# Altium schematic sheet Smart Control and Security System.SchDoc (part 1 of 2)
size 840 x 594 mm; ApprovedBy: Лазарев В.П.; DrawnBy: Лазарев В.П.; SheetTotal: 1; PageSetup: Record=PageOptions|CenterHorizontal=True|CenterVertical=True|PrintScale=1.00|XCorrection=1.00|YCorrection=1.00|PrintKind=0|BorderSize=5000000|LeftOffset=0|BottomOffset=0|Orientation=1|PaperLength=1000|PaperWidth=1000|Scale=100|PaperSource=7|PrintQuality=600|MediaType=1|DitherType=10|PaperKind=A3|PrintScaleMode=0
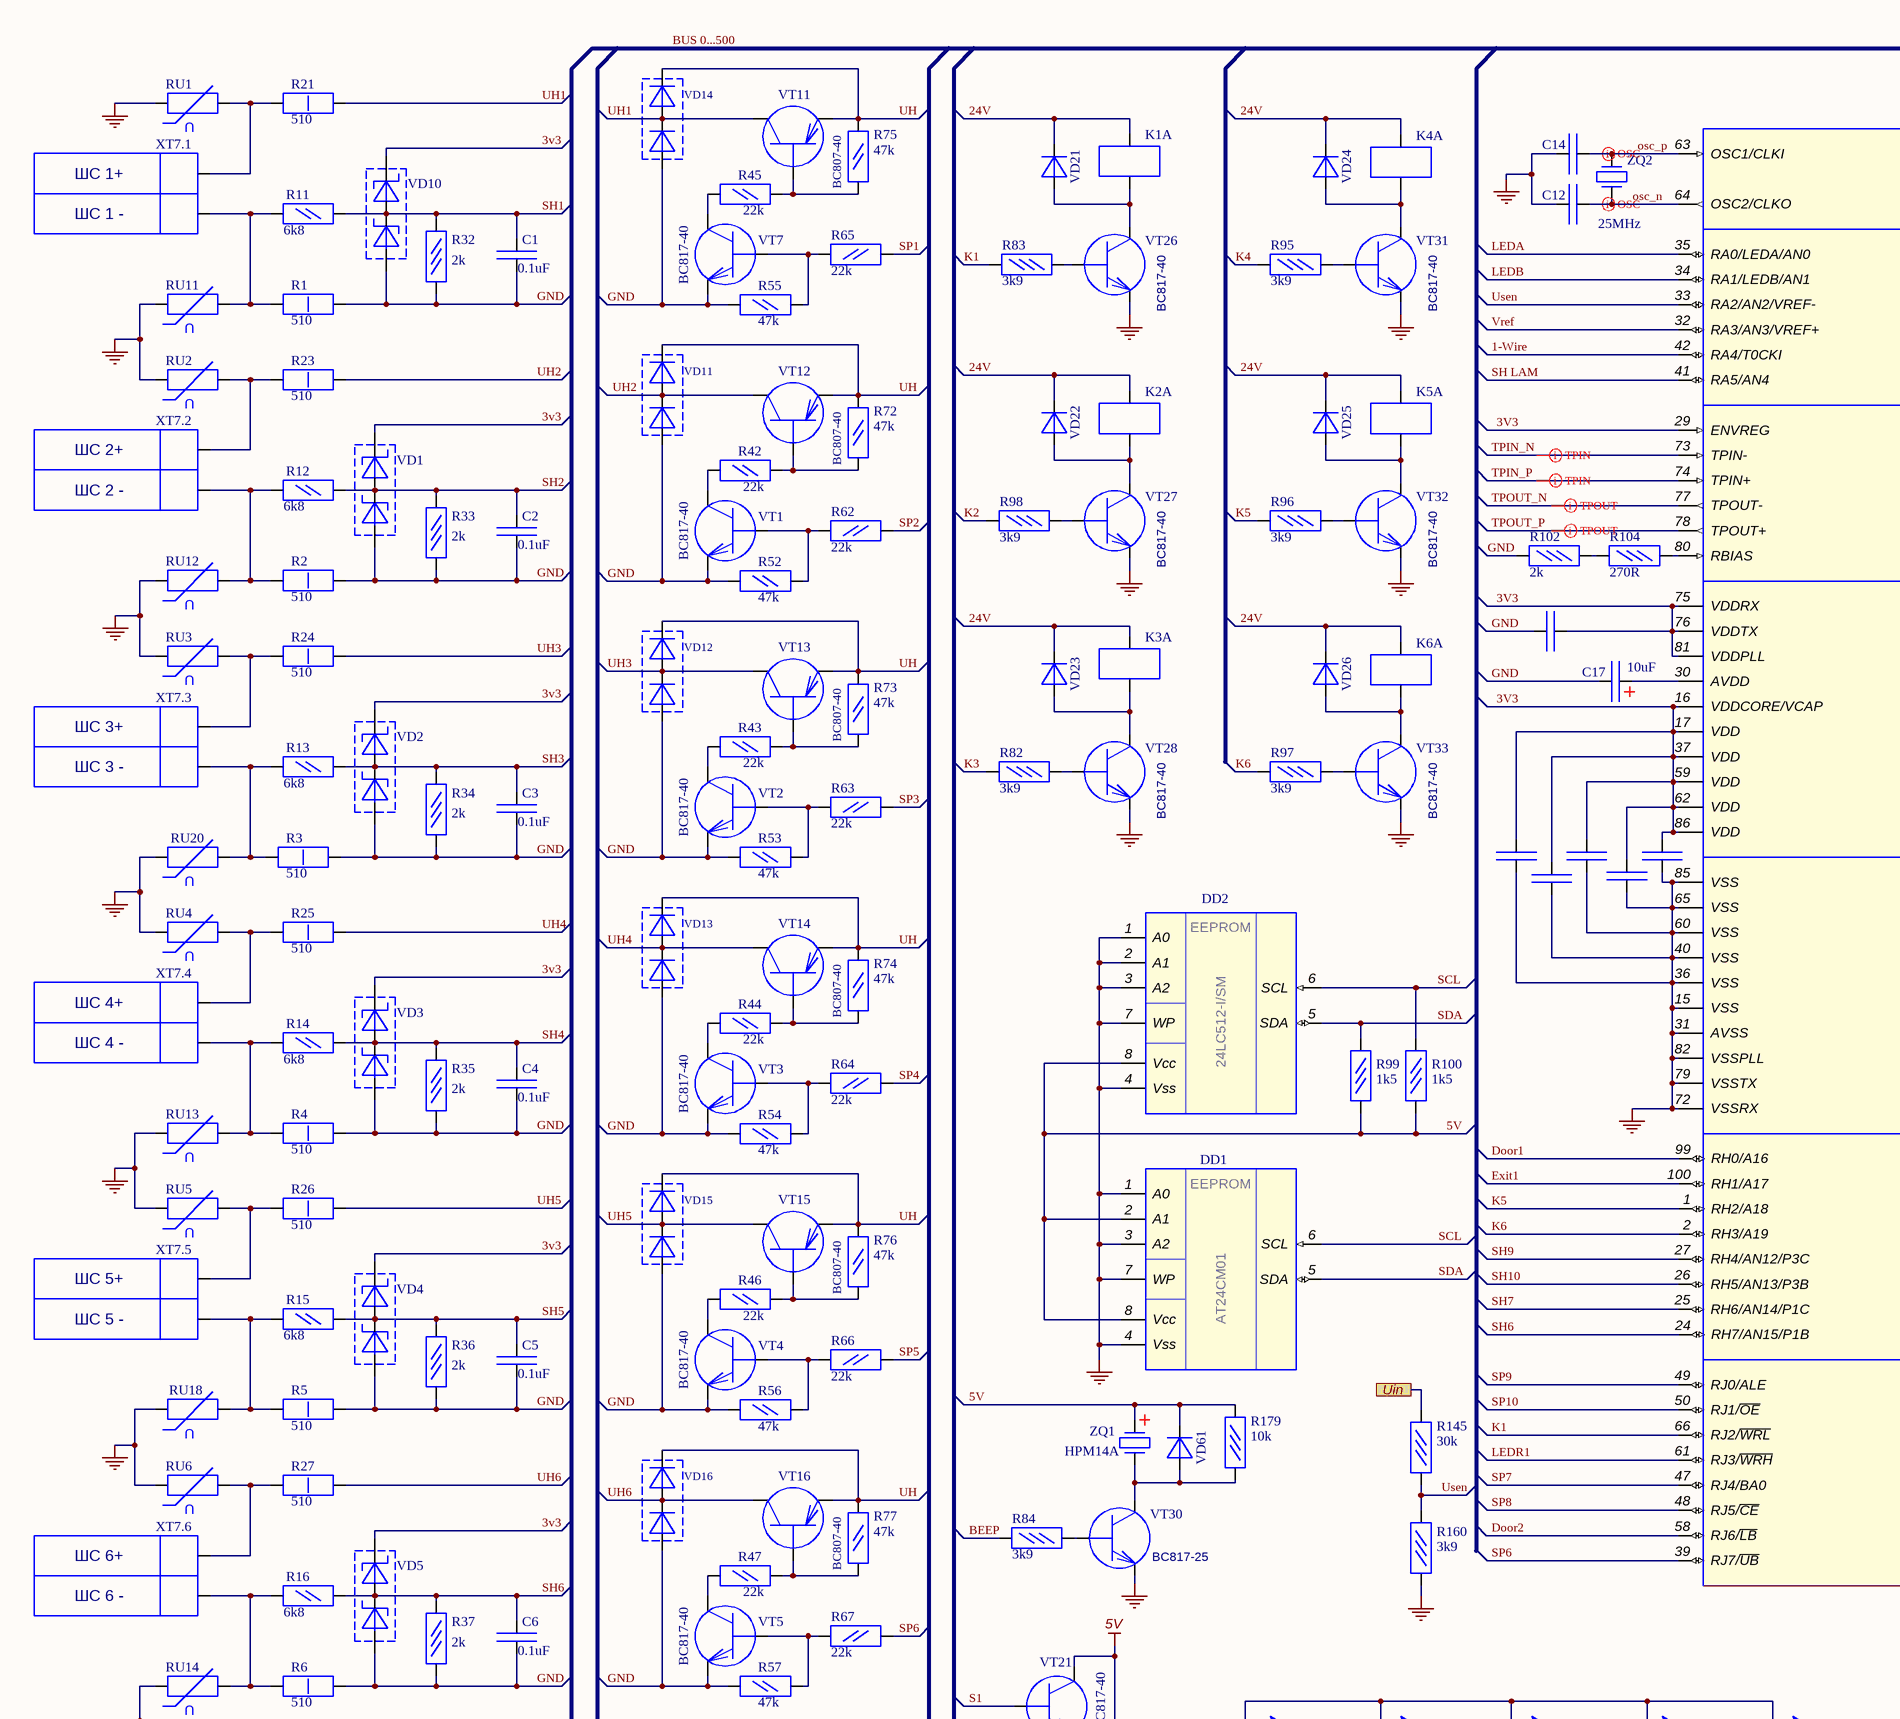
[diagram p0: Smart Control and Security System.SchDoc, top left]
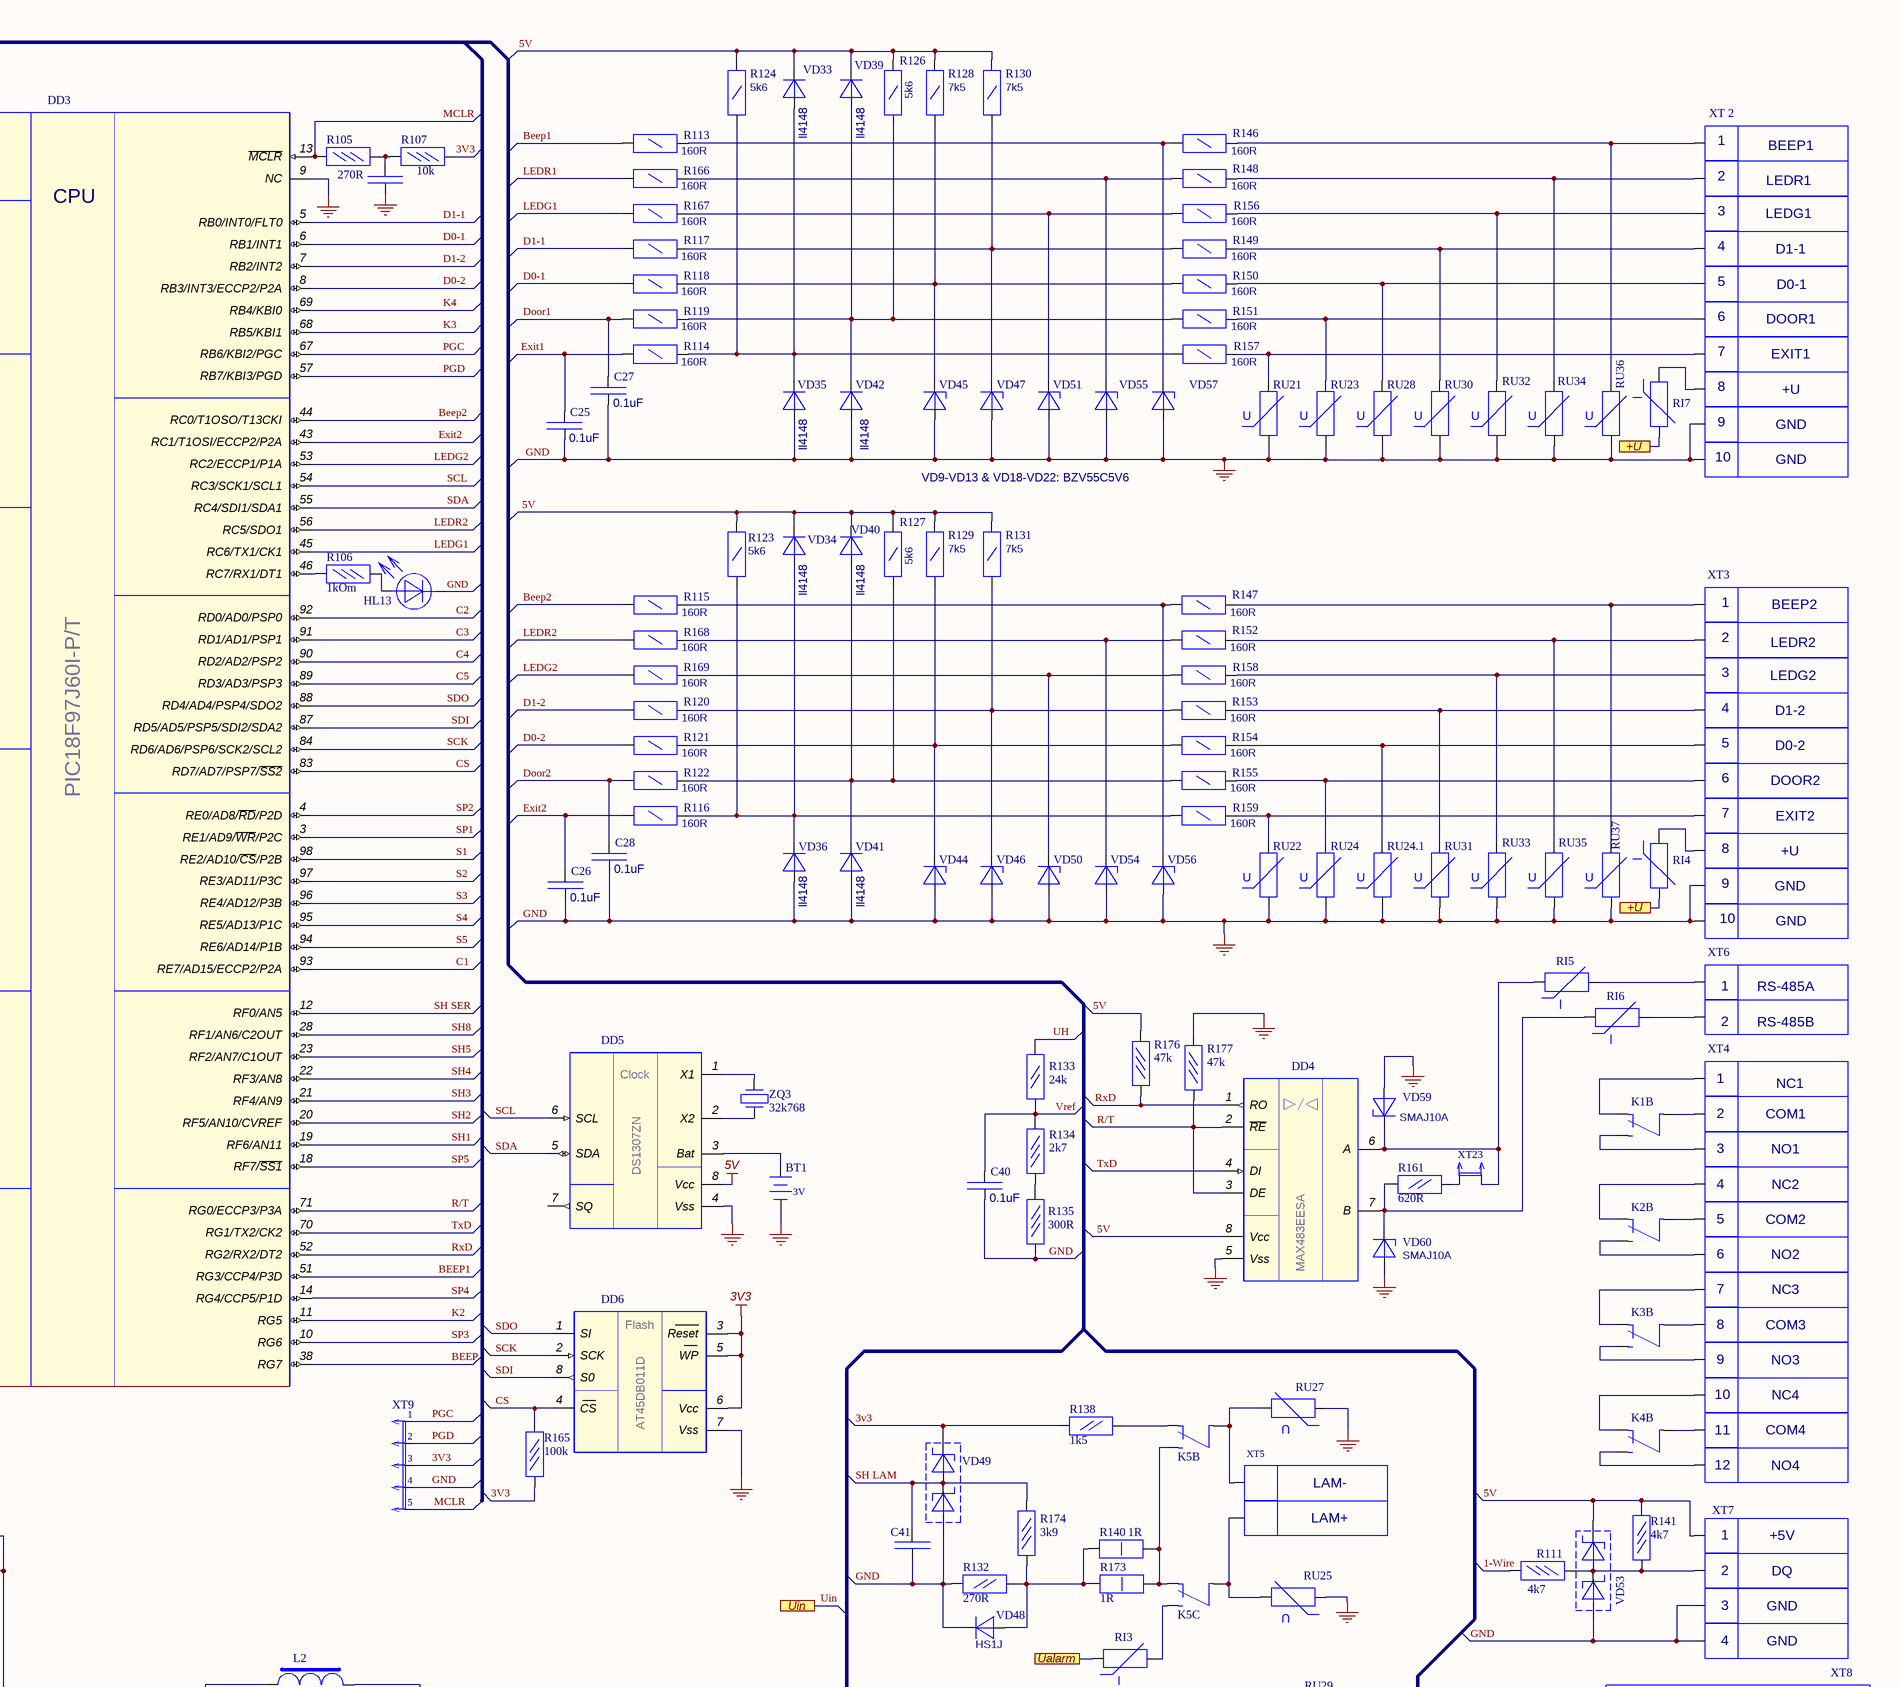
[diagram p1: Smart Control and Security System.SchDoc, top right]
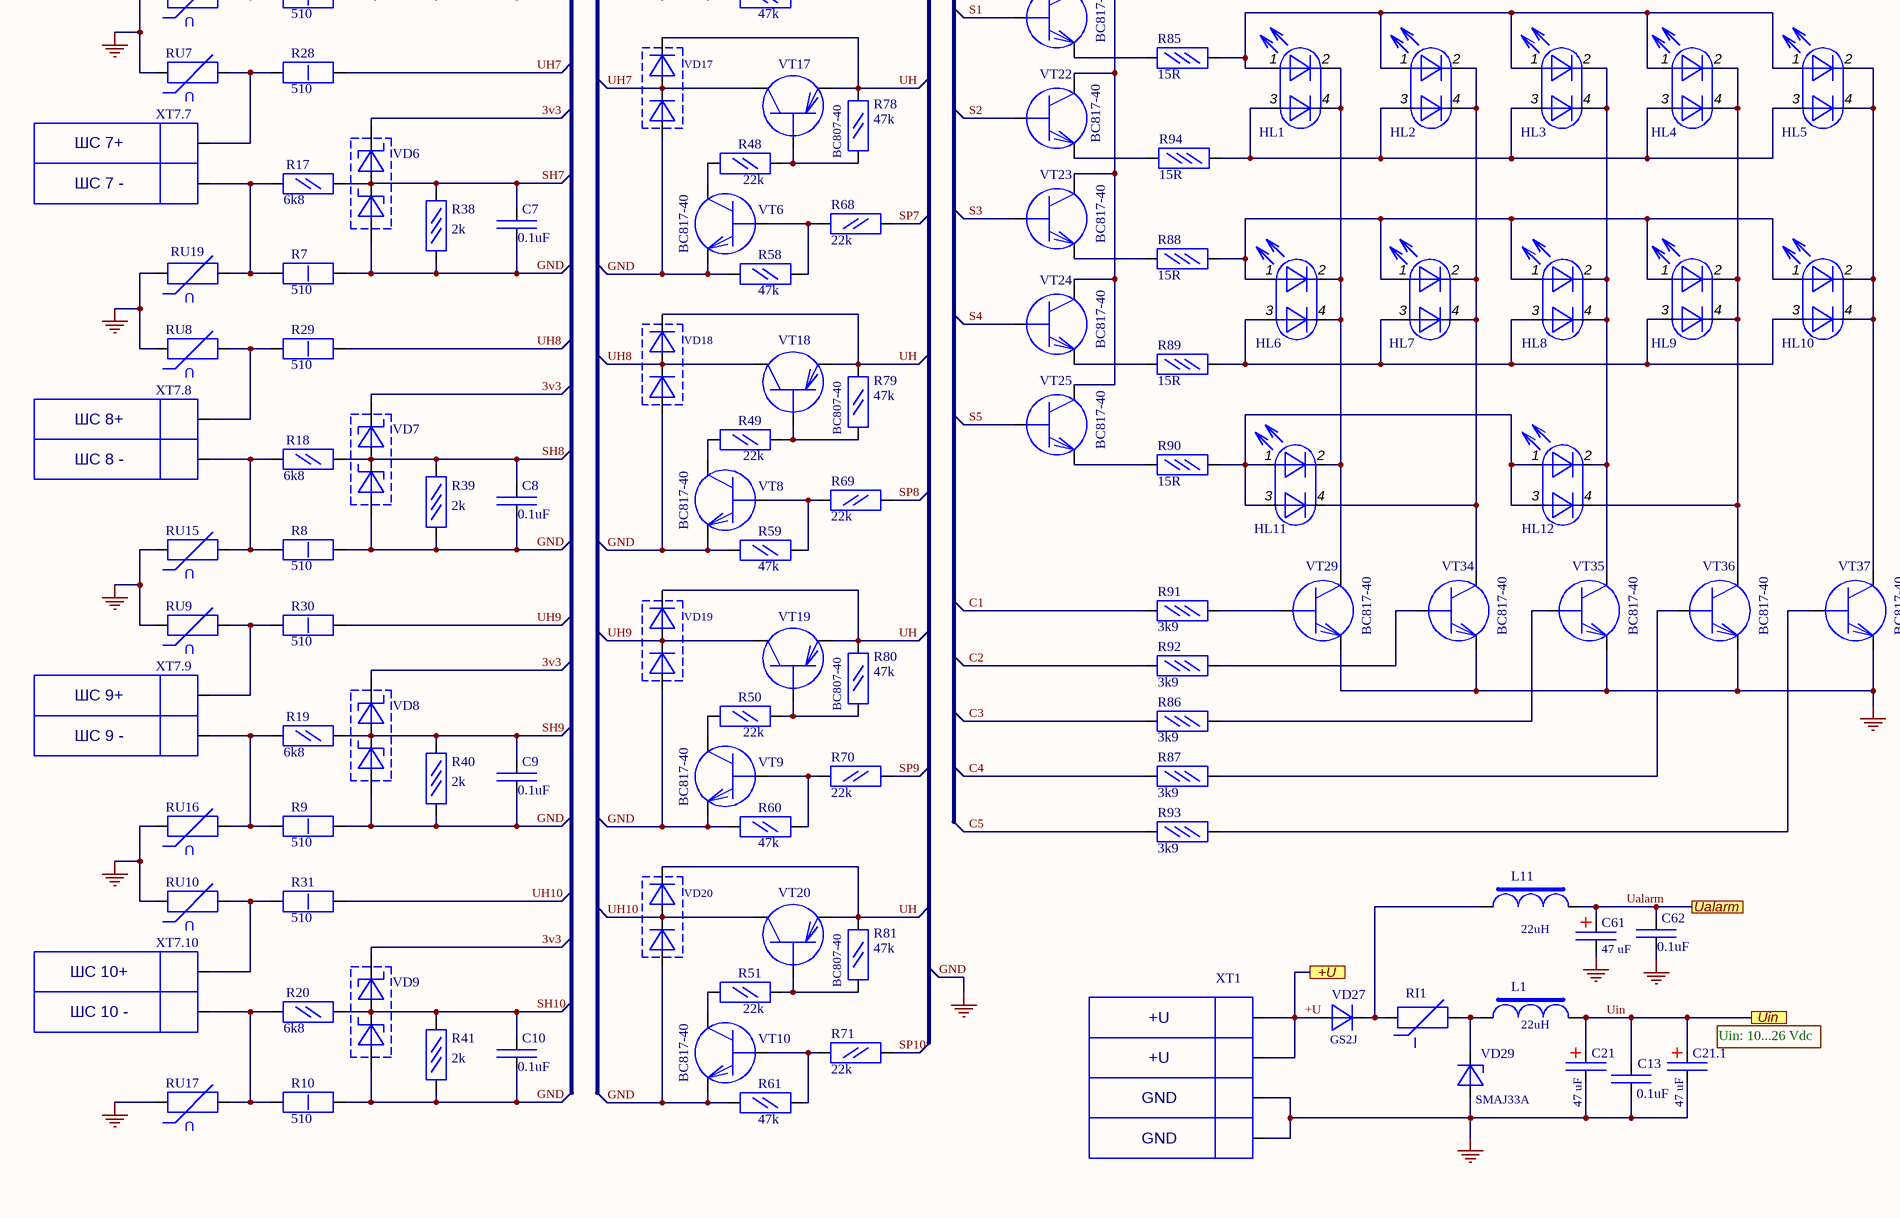
[diagram p2: Smart Control and Security System.SchDoc, bottom left]
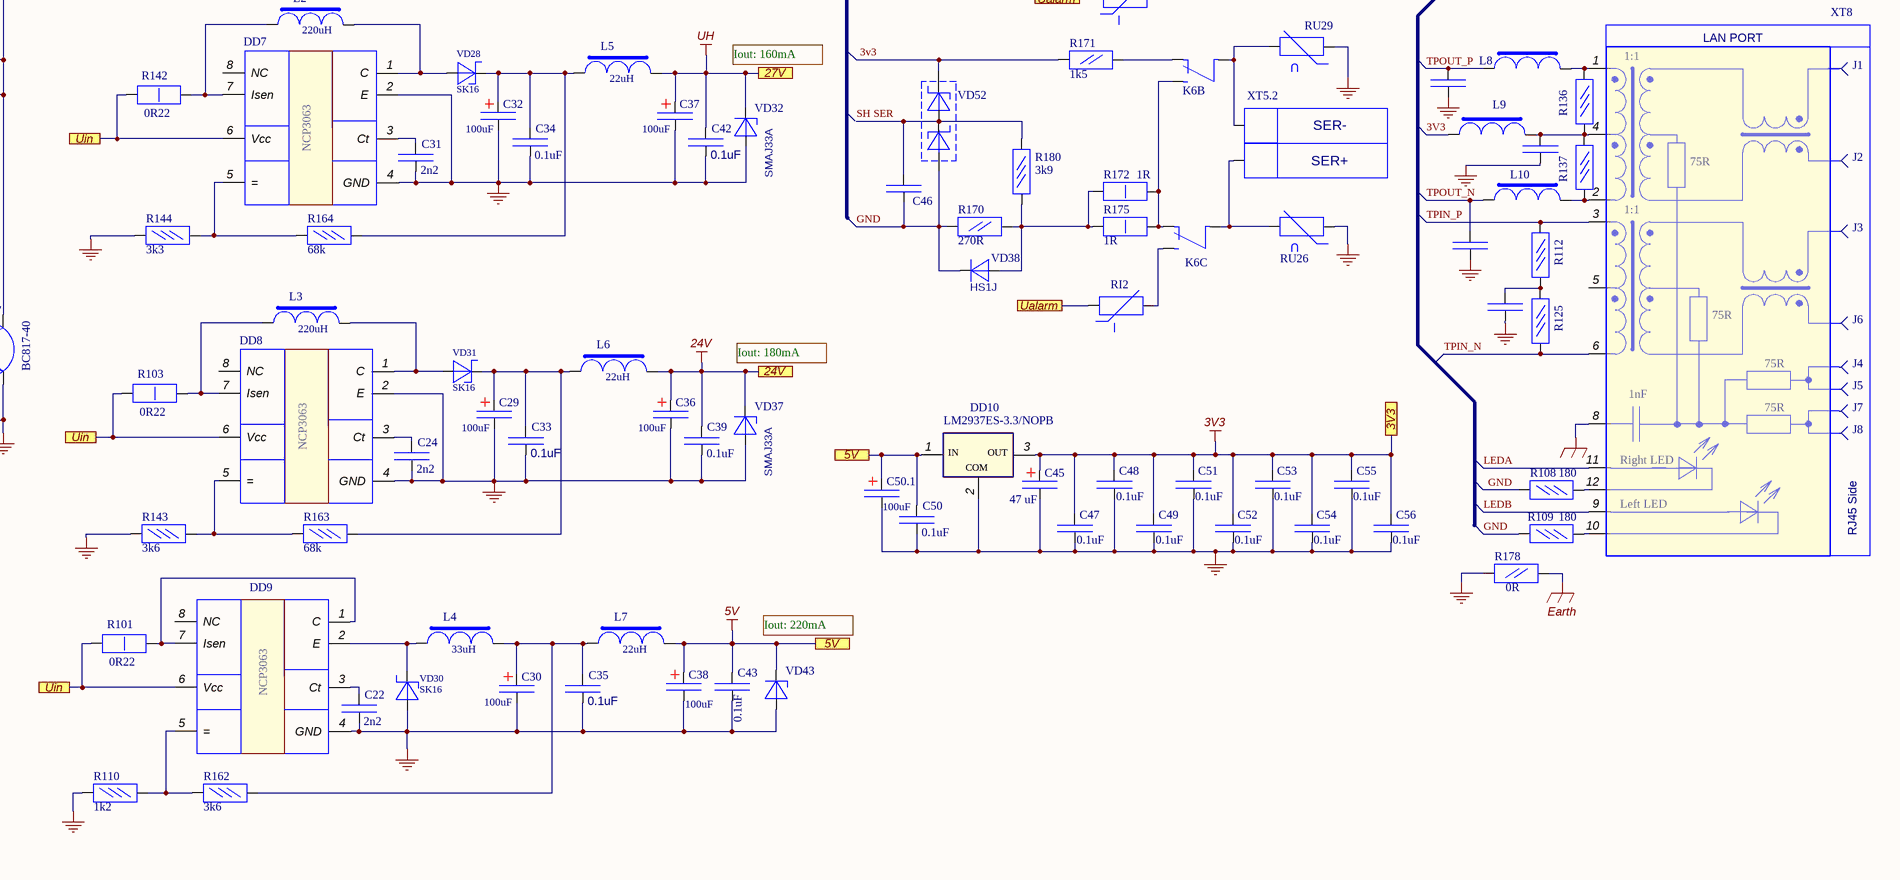
[diagram p3: Smart Control and Security System.SchDoc, bottom right]

## Parts
BT1  3V  [BAT-CR2032]
C1  value 0.1uF  [1608[0603]]  (hidden comment: Cap1)
C2  value 0.1uF  [1608[0603]]  (hidden comment: Cap1)
C3  value 0.1uF  [1608[0603]]  (hidden comment: Cap1)
C4  value 0.1uF  [1608[0603]]  (hidden comment: Cap1)
C5  value 0.1uF  [1608[0603]]  (hidden comment: Cap1)
C6  value 0.1uF  [1608[0603]]  (hidden comment: Cap1)
C7  value 0.1uF  [1608[0603]]  (hidden comment: Cap1)
C8  value 0.1uF  [1608[0603]]  (hidden comment: Cap1)
C9  value 0.1uF  [1608[0603]]  (hidden comment: Cap1)
C10  value 0.1uF  [1608[0603]]  (hidden comment: Cap1)
C11  Cap1  [1608[0603]]  (value not drawn)
C12  Cap1  [1608[0603]]  (value not drawn)
C13  value 0.1uF  [CAPC2012 (0805)]  (hidden comment: Cap1)
C14  Cap1  [1608[0603]]  (value not drawn)
C15  Cap1  [1608[0603]]  (value not drawn)
C16  Cap1  [1608[0603]]  (value not drawn)
C17  value 10uF  [CAPR Tant_A]  (hidden comment: Comment)
C18  Cap1  [1608[0603]]  (value not drawn)
C19  Cap1  [1608[0603]]  (value not drawn)
C20  Cap1  [1608[0603]]  (value not drawn)
C21  value 47 uF  [CAPR E 6.5x12, pitch 2.5]  (hidden comment: Comment)
C21.1  value 47 uF  [CAPR E 6.5x12, pitch 2.5]  (hidden comment: Comment)
C22  value 2n2  [CAPC2012 (0805)]  (hidden comment: Cap1)
C23  Cap1  [1608[0603]]  (value not drawn)
C24  value 2n2  [CAPC2012 (0805)]  (hidden comment: Cap1)
C25  value 0.1uF  [CAPC2012 (0805)]  (hidden comment: Cap1)
C26  value 0.1uF  [CAPC2012 (0805)]  (hidden comment: Cap1)
C27  value 0.1uF  [CAPC2012 (0805)]  (hidden comment: Cap1)
C28  value 0.1uF  [CAPC2012 (0805)]  (hidden comment: Cap1)
C29  value 100uF  [CAPR E 6.5x12, pitch 2.5]  (hidden comment: Comment)
C30  value 100uF  [CAPR E 6.5x12, pitch 2.5]  (hidden comment: Comment)
C31  value 2n2  [CAPC2012 (0805)]  (hidden comment: Cap1)
C32  value 100uF  [CAPR E 6.5x12, pitch 2.5]  (hidden comment: Comment)
C33  value 0.1uF  [CAPC2012 (0805)]  (hidden comment: Cap1)
C34  value 0.1uF  [CAPC2012 (0805)]  (hidden comment: Cap1)
C35  value 0.1uF  [CAPC2012 (0805)]  (hidden comment: Cap1)
C36  value 100uF  [CAPR E 6.5x12, pitch 2.5]  (hidden comment: Comment)
C37  value 100uF  [CAPR E 6.5x12, pitch 2.5]  (hidden comment: Comment)
C38  value 100uF  [CAPR E 6.5x12, pitch 2.5]  (hidden comment: Comment)
C39  value 0.1uF  [CAPC2012 (0805)]  (hidden comment: Cap1)
C40  value 0.1uF  [CAPC2012 (0805)]  (hidden comment: Cap1)
C41  Cap1  [1608[0603]]  (value not drawn)
C42  value 0.1uF  [CAPC2012 (0805)]  (hidden comment: Cap1)
C43  value 0.1uF  [CAPC2012 (0805)]  (hidden comment: Cap1)
C45  value 47 uF  [CAPR E 6.5x12, pitch 2.5]  (hidden comment: Comment)
C46  Cap1  [1608[0603]]  (value not drawn)
C47  value 0.1uF  [1608[0603]]  (hidden comment: Cap1)
C48  value 0.1uF  [1608[0603]]  (hidden comment: Cap1)
C49  value 0.1uF  [1608[0603]]  (hidden comment: Cap1)
C50  value 0.1uF  [CAPC2012 (0805)]  (hidden comment: Cap1)
C50.1  value 100uF  [CAPR E 6.5x12, pitch 2.5]  (hidden comment: Comment)
C51  value 0.1uF  [1608[0603]]  (hidden comment: Cap1)
C52  value 0.1uF  [1608[0603]]  (hidden comment: Cap1)
C53  value 0.1uF  [1608[0603]]  (hidden comment: Cap1)
C54  value 0.1uF  [1608[0603]]  (hidden comment: Cap1)
C55  value 0.1uF  [1608[0603]]  (hidden comment: Cap1)
C56  value 0.1uF  [1608[0603]]  (hidden comment: Cap1)
C57  Cap1  [1608[0603]]  (value not drawn)
C58  Cap1  [1608[0603]]  (value not drawn)
C59  Cap1  [1608[0603]]  (value not drawn)
C60  Cap1  [1608[0603]]  (value not drawn)
C61  value 47 uF  [CAPR E 6.5x12, pitch 2.5]  (hidden comment: Comment)
C62  value 0.1uF  [1608[0603]]  (hidden comment: Cap1)
DD1  Value2: AT24CM01  [SO8_M]  (hidden comment: 24LC512-I/SM)
DD2  24LC512-I/SM  [SO8_M]
DD3  value PIC18F97J60I-P/T  [TQFP-PT100_N]  (hidden comment: PIC18F97J60-IP/T)
DD4  value MAX483EESA  [SO8_M]  (hidden comment: MAX48xx)
DD5  value DS1307ZN  [SO8_M]  (hidden comment: DS1307)
DD6  AT45DB011D  [SO8_M]
DD7  NCP3063  [SO8_M]
DD8  NCP3063  [SO8_M]
DD9  NCP3063  [SO8_M]
DD10  value LM2937ES-3.3/NOPB  [D2PAK_Mod]  (hidden comment: MC78M05BDT)
HL1  LED_R/G  [LED_R/G- 3025]  (value not drawn)
HL2  LED_R/G  [LED_R/G- 3025]  (value not drawn)
HL3  LED_R/G  [LED_R/G- 3025]  (value not drawn)
HL4  LED_R/G  [LED_R/G- 3025]  (value not drawn)
HL5  LED_R/G  [LED_R/G- 3025]  (value not drawn)
HL6  LED_R/G  [LED_R/G- 3025]  (value not drawn)
HL7  LED_R/G  [LED_R/G- 3025]  (value not drawn)
HL8  LED_R/G  [LED_R/G- 3025]  (value not drawn)
HL9  LED_R/G  [LED_R/G- 3025]  (value not drawn)
HL10  LED_R/G  [LED_R/G- 3025]  (value not drawn)
HL11  LED_R/G  [LED_R/G- 3025]  (value not drawn)
HL12  LED_R/G  [LED_R/G- 3025]  (value not drawn)
HL13  LED1_Gost_2  [LED_G- 0603]  (value not drawn)
K1  RTE24024  [Relay_RTE24024]  (value not drawn)  (parts A,B of 3)
K2  RTE24024  [Relay_RTE24024]  (value not drawn)  (parts A,B of 3)
K3  RTE24024  [Relay_RTE24024]  (value not drawn)  (parts A,B of 3)
K4  RTE24024  [Relay_RTE24024]  (value not drawn)  (parts A,B of 3)
K5  RTE24024  [Relay_RTE24024]  (value not drawn)  (parts A,B,C of 3)
K6  RTE24024  [Relay_RTE24024]  (value not drawn)  (parts A,B,C of 3)
L1  Inductance: 22uH  [SDR0805]  (hidden comment: Choke SMD)
L2  Inductance: 220uH  [SDR0805]  (hidden comment: Choke SMD)
L3  Inductance: 220uH  [SDR0805]  (hidden comment: Choke SMD)
L4  Inductance: 33uH  [SDR1006]  (hidden comment: Choke SMD)
L5  Inductance: 22uH  [SDR0805]  (hidden comment: Choke SMD)
L6  Inductance: 22uH  [SDR0805]  (hidden comment: Choke SMD)
L7  Inductance: 22uH  [SDR0805]  (hidden comment: Choke SMD)
L8  Choke SMD  [1608[0603]]  (value not drawn)
L9  Choke SMD  [Choke 0805]  (value not drawn)
L10  Choke SMD  [1608[0603]]  (value not drawn)
L11  Inductance: 22uH  [SDR0805]  (hidden comment: Choke SMD)
R1  value 510  [RESC6332]  (hidden comment: Res 1W)
R2  value 510  [RESC6332]  (hidden comment: Res 1W)
R3  value 510  [RESC6332]  (hidden comment: Res 1W)
R4  value 510  [RESC6332]  (hidden comment: Res 1W)
R5  value 510  [RESC6332]  (hidden comment: Res 1W)
R6  value 510  [RESC6332]  (hidden comment: Res 1W)
R7  value 510  [RESC6332]  (hidden comment: Res 1W)
R8  value 510  [RESC6332]  (hidden comment: Res 1W)
R9  value 510  [RESC6332]  (hidden comment: Res 1W)
R10  value 510  [RESC6332]  (hidden comment: Res 1W)
R11  value 6k8  [RESC2012(0805)]  (hidden comment: Res 1/8W)
R12  value 6k8  [RESC2012(0805)]  (hidden comment: Res 1/8W)
R13  value 6k8  [RESC2012(0805)]  (hidden comment: Res 1/8W)
R14  value 6k8  [RESC2012(0805)]  (hidden comment: Res 1/8W)
R15  value 6k8  [RESC2012(0805)]  (hidden comment: Res 1/8W)
R16  value 6k8  [RESC2012(0805)]  (hidden comment: Res 1/8W)
R17  value 6k8  [RESC2012(0805)]  (hidden comment: Res 1/8W)
R18  value 6k8  [RESC2012(0805)]  (hidden comment: Res 1/8W)
R19  value 6k8  [RESC2012(0805)]  (hidden comment: Res 1/8W)
R20  value 6k8  [RESC2012(0805)]  (hidden comment: Res 1/8W)
R21  value 510  [RESC6332]  (hidden comment: Res 1W)
R23  value 510  [RESC6332]  (hidden comment: Res 1W)
R24  value 510  [RESC6332]  (hidden comment: Res 1W)
R25  value 510  [RESC6332]  (hidden comment: Res 1W)
R26  value 510  [RESC6332]  (hidden comment: Res 1W)
R27  value 510  [RESC6332]  (hidden comment: Res 1W)
R28  value 510  [RESC6332]  (hidden comment: Res 1W)
R29  value 510  [RESC6332]  (hidden comment: Res 1W)
R30  value 510  [RESC6332]  (hidden comment: Res 1W)
R31  value 510  [RESC6332]  (hidden comment: Res 1W)
R32  value 2k  [RESC1608(0603)]  (hidden comment: Res 1/16W)
R33  value 2k  [RESC1608(0603)]  (hidden comment: Res 1/16W)
R34  value 2k  [RESC1608(0603)]  (hidden comment: Res 1/16W)
R35  value 2k  [RESC1608(0603)]  (hidden comment: Res 1/16W)
R36  value 2k  [RESC1608(0603)]  (hidden comment: Res 1/16W)
R37  value 2k  [RESC1608(0603)]  (hidden comment: Res 1/16W)
R38  value 2k  [RESC1608(0603)]  (hidden comment: Res 1/16W)
R39  value 2k  [RESC1608(0603)]  (hidden comment: Res 1/16W)
R40  value 2k  [RESC1608(0603)]  (hidden comment: Res 1/16W)
R41  value 2k  [RESC1608(0603)]  (hidden comment: Res 1/16W)
R42  value 22k  [RESC2012(0805)]  (hidden comment: Res 1/8W)
R43  value 22k  [RESC2012(0805)]  (hidden comment: Res 1/8W)
R44  value 22k  [RESC2012(0805)]  (hidden comment: Res 1/8W)
R45  value 22k  [RESC2012(0805)]  (hidden comment: Res 1/8W)
R46  value 22k  [RESC2012(0805)]  (hidden comment: Res 1/8W)
R47  value 22k  [RESC2012(0805)]  (hidden comment: Res 1/8W)
R48  value 22k  [RESC2012(0805)]  (hidden comment: Res 1/8W)
R49  value 22k  [RESC2012(0805)]  (hidden comment: Res 1/8W)
R50  value 22k  [RESC2012(0805)]  (hidden comment: Res 1/8W)
R51  value 22k  [RESC2012(0805)]  (hidden comment: Res 1/8W)
R52  value 47k  [RESC2012(0805)]  (hidden comment: Res 1/8W)
R53  value 47k  [RESC2012(0805)]  (hidden comment: Res 1/8W)
R54  value 47k  [RESC2012(0805)]  (hidden comment: Res 1/8W)
R55  value 47k  [RESC2012(0805)]  (hidden comment: Res 1/8W)
R56  value 47k  [RESC2012(0805)]  (hidden comment: Res 1/8W)
R57  value 47k  [RESC2012(0805)]  (hidden comment: Res 1/8W)
R58  value 47k  [RESC2012(0805)]  (hidden comment: Res 1/8W)
R59  value 47k  [RESC2012(0805)]  (hidden comment: Res 1/8W)
R60  value 47k  [RESC2012(0805)]  (hidden comment: Res 1/8W)
R61  value 47k  [RESC2012(0805)]  (hidden comment: Res 1/8W)
R62  value 22k  [RESC2012(0805)]  (hidden comment: Res 1/8W)
R63  value 22k  [RESC2012(0805)]  (hidden comment: Res 1/8W)
R64  value 22k  [RESC2012(0805)]  (hidden comment: Res 1/8W)
R65  value 22k  [RESC2012(0805)]  (hidden comment: Res 1/8W)
R66  value 22k  [RESC2012(0805)]  (hidden comment: Res 1/8W)
R67  value 22k  [RESC2012(0805)]  (hidden comment: Res 1/8W)
R68  value 22k  [RESC2012(0805)]  (hidden comment: Res 1/8W)
R69  value 22k  [RESC2012(0805)]  (hidden comment: Res 1/8W)
R70  value 22k  [RESC2012(0805)]  (hidden comment: Res 1/8W)
R71  value 22k  [RESC2012(0805)]  (hidden comment: Res 1/8W)
R72  value 47k  [RESC2012(0805)]  (hidden comment: Res 1/8W)
R73  value 47k  [RESC2012(0805)]  (hidden comment: Res 1/8W)
R74  value 47k  [RESC2012(0805)]  (hidden comment: Res 1/8W)
R75  value 47k  [RESC2012(0805)]  (hidden comment: Res 1/8W)
R76  value 47k  [RESC2012(0805)]  (hidden comment: Res 1/8W)
R77  value 47k  [RESC2012(0805)]  (hidden comment: Res 1/8W)
R78  value 47k  [RESC2012(0805)]  (hidden comment: Res 1/8W)
R79  value 47k  [RESC2012(0805)]  (hidden comment: Res 1/8W)
R80  value 47k  [RESC2012(0805)]  (hidden comment: Res 1/8W)
R81  value 47k  [RESC2012(0805)]  (hidden comment: Res 1/8W)
R82  value 3k9  [RESC1608(0603)]  (hidden comment: Res 1/16W)
R83  value 3k9  [RESC1608(0603)]  (hidden comment: Res 1/16W)
R84  value 3k9  [RESC1608(0603)]  (hidden comment: Res 1/16W)
R85  value 15R  [RESC1608(0603)]  (hidden comment: Res 1/16W)
R86  value 3k9  [RESC1608(0603)]  (hidden comment: Res 1/16W)
R87  value 3k9  [RESC1608(0603)]  (hidden comment: Res 1/16W)
R88  value 15R  [RESC1608(0603)]  (hidden comment: Res 1/16W)
R89  value 15R  [RESC1608(0603)]  (hidden comment: Res 1/16W)
R90  value 15R  [RESC1608(0603)]  (hidden comment: Res 1/16W)
R91  value 3k9  [RESC1608(0603)]  (hidden comment: Res 1/16W)
R92  value 3k9  [RESC1608(0603)]  (hidden comment: Res 1/16W)
R93  value 3k9  [RESC1608(0603)]  (hidden comment: Res 1/16W)
R94  value 15R  [RESC1608(0603)]  (hidden comment: Res 1/16W)
R95  value 3k9  [RESC1608(0603)]  (hidden comment: Res 1/16W)
R96  value 3k9  [RESC1608(0603)]  (hidden comment: Res 1/16W)
R97  value 3k9  [RESC1608(0603)]  (hidden comment: Res 1/16W)
R98  value 3k9  [RESC1608(0603)]  (hidden comment: Res 1/16W)
R99  value 1k5  [RESC1608(0603)]  (hidden comment: Res 1/16W)
R100  value 1k5  [RESC1608(0603)]  (hidden comment: Res 1/16W)
R101  value 0R22  [RESC6332]  (hidden comment: Res 1W)
R102  value 2k  [RESC1608(0603)]  (hidden comment: Res 1/16W)
R103  value 0R22  [RESC6332]  (hidden comment: Res 1W)
R104  value 270R  [RESC1608(0603)]  (hidden comment: Res 1/16W)
R105  value 270R  [RESC1608(0603)]  (hidden comment: Res 1/16W)
R106  value 1kOm  [RESC1608(0603)]  (hidden comment: Res 1/16W)
R107  value 10k  [RESC1608(0603)]  (hidden comment: Res 1/16W)
R108  value 180  [RESC1608(0603)]  (hidden comment: Res 1/16W)
R109  value 180  [RESC1608(0603)]  (hidden comment: Res 1/16W)
R110  value 1k2  [RESC1608(0603)]  (hidden comment: Res 1/16W)
R111  value 4k7  [RESC1608(0603)]  (hidden comment: Res 1/16W)
R112  Res 1/16W  [RESC1608(0603)]  (value not drawn)
R113  value 160R  [RESC3216(1206)N]  (hidden comment: Res 1/4W)
R114  value 160R  [RESC3216(1206)N]  (hidden comment: Res 1/4W)
R115  value 160R  [RESC3216(1206)N]  (hidden comment: Res 1/4W)
R116  value 160R  [RESC3216(1206)N]  (hidden comment: Res 1/4W)
R117  value 160R  [RESC3216(1206)N]  (hidden comment: Res 1/4W)
R118  value 160R  [RESC3216(1206)N]  (hidden comment: Res 1/4W)
R119  value 160R  [RESC3216(1206)N]  (hidden comment: Res 1/4W)
R120  value 160R  [RESC3216(1206)N]  (hidden comment: Res 1/4W)
R121  value 160R  [RESC3216(1206)N]  (hidden comment: Res 1/4W)
R122  value 160R  [RESC3216(1206)N]  (hidden comment: Res 1/4W)
R123  value 5k6  [RESC3216(1206)N]  (hidden comment: Res 1/4W)
R124  value 5k6  [RESC3216(1206)N]  (hidden comment: Res 1/4W)
R125  Res 1/16W  [RESC1608(0603)]  (value not drawn)
R126  value 5k6  [RESC3216(1206)N]  (hidden comment: Res 1/4W)
R127  value 5k6  [RESC3216(1206)N]  (hidden comment: Res 1/4W)
R128  value 7k5  [RESC3216(1206)N]  (hidden comment: Res 1/4W)
R129  value 7k5  [RESC3216(1206)N]  (hidden comment: Res 1/4W)
R130  value 7k5  [RESC3216(1206)N]  (hidden comment: Res 1/4W)
R131  value 7k5  [RESC3216(1206)N]  (hidden comment: Res 1/4W)
R132  value 270R  [RESC2012(0805)]  (hidden comment: Res 1/8W)
R133  value 24k  [RESC2012(0805)]  (hidden comment: Res 1/8W)
R134  value 2k7  [RESC1608(0603)]  (hidden comment: Res 1/16W)
R135  value 300R  [RESC1608(0603)]  (hidden comment: Res 1/16W)
R136  Res 1/16W  [RESC1608(0603)]  (value not drawn)
R137  Res 1/16W  [RESC1608(0603)]  (value not drawn)
R138  value 1k5  [RESC2012(0805)]  (hidden comment: Res 1/8W)
R140  value 1R  [RESC6332]  (hidden comment: Res 1W)
R141  value 4k7  [RESC1608(0603)]  (hidden comment: Res 1/16W)
R142  value 0R22  [RESC6332]  (hidden comment: Res 1W)
R143  value 3k6  [RESC1608(0603)]  (hidden comment: Res 1/16W)
R144  value 3k3  [RESC1608(0603)]  (hidden comment: Res 1/16W)
R145  value 30k  [RESC1608(0603)]  (hidden comment: Res 1/16W)
R146  value 160R  [RESC3216(1206)N]  (hidden comment: Res 1/4W)
R147  value 160R  [RESC3216(1206)N]  (hidden comment: Res 1/4W)
R148  value 160R  [RESC3216(1206)N]  (hidden comment: Res 1/4W)
R149  value 160R  [RESC3216(1206)N]  (hidden comment: Res 1/4W)
R150  value 160R  [RESC3216(1206)N]  (hidden comment: Res 1/4W)
R151  value 160R  [RESC3216(1206)N]  (hidden comment: Res 1/4W)
R152  value 160R  [RESC3216(1206)N]  (hidden comment: Res 1/4W)
R153  value 160R  [RESC3216(1206)N]  (hidden comment: Res 1/4W)
R154  value 160R  [RESC3216(1206)N]  (hidden comment: Res 1/4W)
R155  value 160R  [RESC3216(1206)N]  (hidden comment: Res 1/4W)
R156  value 160R  [RESC3216(1206)N]  (hidden comment: Res 1/4W)
R157  value 160R  [RESC3216(1206)N]  (hidden comment: Res 1/4W)
R158  value 160R  [RESC3216(1206)N]  (hidden comment: Res 1/4W)
R159  value 160R  [RESC3216(1206)N]  (hidden comment: Res 1/4W)
R160  value 3k9  [RESC1608(0603)]  (hidden comment: Res 1/16W)
R161  value 620R  [RESC2012(0805)]  (hidden comment: Res 1/8W)
R162  value 3k6  [RESC1608(0603)]  (hidden comment: Res 1/16W)
R163  value 68k  [RESC1608(0603)]  (hidden comment: Res 1/16W)
R164  value 68k  [RESC1608(0603)]  (hidden comment: Res 1/16W)
R165  value 100k  [RESC1608(0603)]  (hidden comment: Res 1/16W)
R166  value 160R  [RESC3216(1206)N]  (hidden comment: Res 1/4W)
R167  value 160R  [RESC3216(1206)N]  (hidden comment: Res 1/4W)
R168  value 160R  [RESC3216(1206)N]  (hidden comment: Res 1/4W)
R169  value 160R  [RESC3216(1206)N]  (hidden comment: Res 1/4W)
R170  value 270R  [RESC2012(0805)]  (hidden comment: Res 1/8W)
R171  value 1k5  [RESC2012(0805)]  (hidden comment: Res 1/8W)
R172  value 1R  [RESC6332]  (hidden comment: Res 1W)
R173  value 1R  [RESC6332]  (hidden comment: Res 1W)
R174  value 3k9  [RESC1608(0603)]  (hidden comment: Res 1/16W)
R175  value 1R  [RESC6332]  (hidden comment: Res 1W)
R176  value 47k  [RESC1608(0603)]  (hidden comment: Res 1/16W)
R177  value 47k  [RESC1608(0603)]  (hidden comment: Res 1/16W)
R178  value 0R  [RESC2012(0805)]  (hidden comment: Res 1/8W)
R179  value 10k  [RESC1608(0603)]  (hidden comment: Res 1/16W)
R180  value 3k9  [RESC1608(0603)]  (hidden comment: Res 1/16W)
RI1  MF-MSMF010  [Multy_Fuse 1812]  (value not drawn)
RI2  MF-MSMF010  [Multy_Fuse 1812]  (value not drawn)
RI3  MF-MSMF010  [Multy_Fuse 1812]  (value not drawn)
RI4  MF-MSMF010  [Multy_Fuse 1812]  (value not drawn)
RI5  MF-MSMF010  [Multy_Fuse 1812]  (value not drawn)
RI6  MF-MSMF010  [Multy_Fuse 1812]  (value not drawn)
RI7  MF-MSMF010  [Multy_Fuse 1812]  (value not drawn)
RU1  Varistor_hor  [CN1206]  (value not drawn)
RU2  Varistor_hor  [CN1206]  (value not drawn)
RU3  Varistor_hor  [CN1206]  (value not drawn)
RU4  Varistor_hor  [CN1206]  (value not drawn)
RU5  Varistor_hor  [CN1206]  (value not drawn)
RU6  Varistor_hor  [CN1206]  (value not drawn)
RU7  Varistor_hor  [CN1206]  (value not drawn)
RU8  Varistor_hor  [CN1206]  (value not drawn)
RU9  Varistor_hor  [CN1206]  (value not drawn)
RU10  Varistor_hor  [CN1206]  (value not drawn)
RU11  Varistor_hor  [CN1206]  (value not drawn)
RU12  Varistor_hor  [CN1206]  (value not drawn)
RU13  Varistor_hor  [CN1206]  (value not drawn)
RU14  Varistor_hor  [CN1206]  (value not drawn)
RU15  Varistor_hor  [CN1206]  (value not drawn)
RU16  Varistor_hor  [CN1206]  (value not drawn)
RU17  Varistor_hor  [CN1206]  (value not drawn)
RU18  Varistor_hor  [CN1206]  (value not drawn)
RU19  Varistor_hor  [CN1206]  (value not drawn)
RU20  Varistor_hor  [CN1206]  (value not drawn)
RU21  Varistor  [CN1206]  (value not drawn)
RU22  Varistor  [CN1206]  (value not drawn)
RU23  Varistor  [CN1206]  (value not drawn)
RU24  Varistor  [CN1206]  (value not drawn)
RU24.1  Varistor  [CN1206]  (value not drawn)
RU25  Varistor_hor  [CN1206]  (value not drawn)
RU26  Varistor_hor  [CN1206]  (value not drawn)
RU27  Varistor_hor  [CN1206]  (value not drawn)
RU28  Varistor  [CN1206]  (value not drawn)
RU29  Varistor_hor  [CN1206]  (value not drawn)
RU30  Varistor  [CN1206]  (value not drawn)
RU31  Varistor  [CN1206]  (value not drawn)
RU32  Varistor  [CN1206]  (value not drawn)
RU33  Varistor  [CN1206]  (value not drawn)
RU34  Varistor  [CN1206]  (value not drawn)
RU35  Varistor  [CN1206]  (value not drawn)
RU36  Varistor  [CN1206]  (value not drawn)
RU37  Varistor  [CN1206]  (value not drawn)
VD1  BAS70-04  [SOT23_M1]  (value not drawn)
VD2  BAS70-04  [SOT23_M1]  (value not drawn)
VD3  BAS70-04  [SOT23_M1]  (value not drawn)
VD4  BAS70-04  [SOT23_M1]  (value not drawn)
VD5  BAS70-04  [SOT23_M1]  (value not drawn)
VD6  BAS70-04  [SOT23_M1]  (value not drawn)
VD7  BAS70-04  [SOT23_M1]  (value not drawn)
VD8  BAS70-04  [SOT23_M1]  (value not drawn)
VD9  BAS70-04  [SOT23_M1]  (value not drawn)
VD10  BAS70-04  [SOT23_M1]  (value not drawn)
VD11  BAV99W  [SOT323]  (value not drawn)
VD12  BAV99W  [SOT323]  (value not drawn)
VD13  BAV99W  [SOT323]  (value not drawn)
VD14  BAV99W  [SOT323]  (value not drawn)
VD15  BAV99W  [SOT323]  (value not drawn)
VD16  BAV99W  [SOT323]  (value not drawn)
VD17  BAV99W  [SOT323]  (value not drawn)
VD18  BAV99W  [SOT323]  (value not drawn)
VD19  BAV99W  [SOT323]  (value not drawn)
VD20  BAV99W  [SOT323]  (value not drawn)
VD21  Diode LL4148  [MELF-D3516-1406]  (value not drawn)
VD22  Diode LL4148  [MELF-D3516-1406]  (value not drawn)
VD23  Diode LL4148  [MELF-D3516-1406]  (value not drawn)
VD24  Diode LL4148  [MELF-D3516-1406]  (value not drawn)
VD25  Diode LL4148  [MELF-D3516-1406]  (value not drawn)
VD26  Diode LL4148  [MELF-D3516-1406]  (value not drawn)
VD27  value GS2J  [CD4532-1812 (mod)]  (hidden comment: Diode1)
VD28  value SK16  [SMB(DO-214AA)]  (hidden comment: Diode SK16)
VD29  value SMAJ33A  [SMA(DO-214AC)]  (hidden comment: Diode Zener)
VD30  value SK16  [SMB(DO-214AA)]  (hidden comment: Diode SK16)
VD31  value SK16  [SMB(DO-214AA)]  (hidden comment: Diode SK16)
VD32  value SMAJ33A  [SMA(DO-214AC)]  (hidden comment: Diode Zener)
VD33  value ll4148  [MELF-D3516-1406]  (hidden comment: Diode LL4148)
VD34  value ll4148  [MELF-D3516-1406]  (hidden comment: Diode LL4148)
VD35  value ll4148  [MELF-D3516-1406]  (hidden comment: Diode LL4148)
VD36  value ll4148  [MELF-D3516-1406]  (hidden comment: Diode LL4148)
VD37  value SMAJ33A  [SMA(DO-214AC)]  (hidden comment: Diode Zener)
VD38  value HS1J  [CD4532-1812 (mod)]  (hidden comment: Diode1)
VD39  value ll4148  [MELF-D3516-1406]  (hidden comment: Diode LL4148)
VD40  value ll4148  [MELF-D3516-1406]  (hidden comment: Diode LL4148)
VD41  value ll4148  [MELF-D3516-1406]  (hidden comment: Diode LL4148)
VD42  value ll4148  [MELF-D3516-1406]  (hidden comment: Diode LL4148)
VD43  Diode Zener  [SMA(DO-214AC)]  (value not drawn)
VD44  Diode Zener  [MELF-D3516-1406]  (value not drawn)
VD45  Diode Zener  [MELF-D3516-1406]  (value not drawn)
VD46  Diode Zener  [MELF-D3516-1406]  (value not drawn)
VD47  Diode Zener  [MELF-D3516-1406]  (value not drawn)
VD48  value HS1J  [CD4532-1812 (mod)]  (hidden comment: Diode1)
VD49  BAS70-04  [SOT23_M1]  (value not drawn)
VD50  Diode Zener  [MELF-D3516-1406]  (value not drawn)
VD51  Diode Zener  [MELF-D3516-1406]  (value not drawn)
VD52  BAS70-04  [SOT23_M1]  (value not drawn)
VD53  BAS70-04  [SOT23_M1]  (value not drawn)
VD54  Diode Zener  [MELF-D3516-1406]  (value not drawn)
VD55  Diode Zener  [MELF-D3516-1406]  (value not drawn)
VD56  Diode Zener  [MELF-D3516-1406]  (value not drawn)
VD57  Diode Zener  [MELF-D3516-1406]  (value not drawn)
VD59  value SMAJ10A  [SMA(DO-214AC)]  (hidden comment: Diode Zener)
VD60  value SMAJ10A  [SMA(DO-214AC)]  (hidden comment: Diode Zener)
VD61  Diode LL4148  [MELF-D3516-1406]  (value not drawn)
VT1  value BC817-40  [SOT-23_3D]  (hidden comment: BC817)
VT2  value BC817-40  [SOT-23_3D]  (hidden comment: BC817)
VT3  value BC817-40  [SOT-23_3D]  (hidden comment: BC817)
VT4  value BC817-40  [SOT-23_3D]  (hidden comment: BC817)
VT5  value BC817-40  [SOT-23_3D]  (hidden comment: BC817)
VT6  value BC817-40  [SOT-23_3D]  (hidden comment: BC817)
VT7  value BC817-40  [SOT-23_3D]  (hidden comment: BC817)
VT8  value BC817-40  [SOT-23_3D]  (hidden comment: BC817)
VT9  value BC817-40  [SOT-23_3D]  (hidden comment: BC817)
VT10  value BC817-40  [SOT-23_3D]  (hidden comment: BC817)
VT11  value BC807-40  [SOT-23_3D]  (hidden comment: BC807)
VT12  value BC807-40  [SOT-23_3D]  (hidden comment: BC807)
VT13  value BC807-40  [SOT-23_3D]  (hidden comment: BC807)
VT14  value BC807-40  [SOT-23_3D]  (hidden comment: BC807)
VT15  value BC807-40  [SOT-23_3D]  (hidden comment: BC807)
VT16  value BC807-40  [SOT-23_3D]  (hidden comment: BC807)
VT17  value BC807-40  [SOT-23_3D]  (hidden comment: BC807)
VT18  value BC807-40  [SOT-23_3D]  (hidden comment: BC807)
VT19  value BC807-40  [SOT-23_3D]  (hidden comment: BC807)
VT20  value BC807-40  [SOT-23_3D]  (hidden comment: BC807)
VT21  value BC817-40  [SOT-23_3D]  (hidden comment: BC817)
VT22  value BC817-40  [SOT-23_3D]  (hidden comment: BC817)
VT23  value BC817-40  [SOT-23_3D]  (hidden comment: BC817)
VT24  value BC817-40  [SOT-23_3D]  (hidden comment: BC817)
VT25  value BC817-40  [SOT-23_3D]  (hidden comment: BC817)
VT26  value BC817-40  [SOT-23_3D]  (hidden comment: BC847)
VT27  value BC817-40  [SOT-23_3D]  (hidden comment: BC847)
VT28  value BC817-40  [SOT-23_3D]  (hidden comment: BC847)
VT29  value BC817-40  [SOT-23_3D]  (hidden comment: BC817)
VT30  value BC817-25  [SOT-23_3D]  (hidden comment: BC847)
VT31  value BC817-40  [SOT-23_3D]  (hidden comment: BC847)
VT32  value BC817-40  [SOT-23_3D]  (hidden comment: BC847)
VT33  value BC817-40  [SOT-23_3D]  (hidden comment: BC847)
VT34  value BC817-40  [SOT-23_3D]  (hidden comment: BC817)
VT35  value BC817-40  [SOT-23_3D]  (hidden comment: BC817)
VT36  value BC817-40  [SOT-23_3D]  (hidden comment: BC817)
VT37  value BC817-40  [SOT-23_3D]  (hidden comment: BC817)
XT1.1  Connect x2_1  [Connector Screw 2pin]  (value not drawn)
XT1.2  XT1  [Connector Screw 2pin]
XT2.1  XT 2  [Connector Screw 2pin]
XT2.2  Connect x2_1  [Connector Screw 2pin]  (value not drawn)
XT2.3  Connect x2_1  [Connector Screw 2pin]  (value not drawn)
XT2.4  Connect x2_1  [Connector Screw 2pin]  (value not drawn)
XT2.5  Connect x2_1  [Connector Screw 2pin]  (value not drawn)
XT3.1  XT3  [Connector Screw 2pin]
XT3.2  Connect x2_1  [Connector Screw 2pin]  (value not drawn)
XT3.3  Connect x2_1  [Connector Screw 2pin]  (value not drawn)
XT3.4  Connect x2_1  [Connector Screw 2pin]  (value not drawn)
XT3.5  Connect x2_1  [Connector Screw 2pin]  (value not drawn)
XT4.1  XT4  [Connector Screw 2pin]
XT4.2  Connect x2_1  [Connector Screw 2pin]  (value not drawn)
XT4.3  Connect x2_1  [Connector Screw 2pin]  (value not drawn)
XT4.4  XT4  [Connector Screw 2pin]  (value not drawn)
XT4.5  XT4  [Connector Screw 2pin]  (value not drawn)
XT4.6  XT4  [Connector Screw 2pin]  (value not drawn)
XT5.1  XT5  [Connector Screw 2pin]
XT5.2  Connect x2_1  [Connector Screw 2pin]  (value not drawn)
XT6  Connect x2_1  [Connector Screw 2pin]  (value not drawn)
XT6.1  XT7  [Connector Screw 2pin]
XT6.2  Connect x2_1  [Connector Screw 2pin]  (value not drawn)
XT7.1  XT7  [Connector Screw 2pin]  (value not drawn)
XT7.2  Connect x2_1  [Connector Screw 2pin]  (value not drawn)
XT7.3  Connect x2_1  [Connector Screw 2pin]  (value not drawn)
XT7.4  Connect x2_1  [Connector Screw 2pin]  (value not drawn)
XT7.5  Connect x2_1  [Connector Screw 2pin]  (value not drawn)
XT7.6  Connect x2_1  [Connector Screw 2pin]  (value not drawn)
XT7.7  Connect x2_1  [Connector Screw 2pin]  (value not drawn)
XT7.8  Connect x2_1  [Connector Screw 2pin]  (value not drawn)
XT7.9  Connect x2_1  [Connector Screw 2pin]  (value not drawn)
XT7.10  Connect x2_1  [Connector Screw 2pin]  (value not drawn)
XT8  LAN-Port  [RJ45-8P8C]  (value not drawn)
XT9  Connect x5  [Connect-5pin_1row]  (value not drawn)
XT23  Connect x2  [PLS 2pin]  (value not drawn)
ZQ1  value HPM14A  [HCM1606X]  (hidden comment: Buzzer)
ZQ2  value 25MHz  [HC-49sm]  (hidden comment: XTAL_1)
ZQ3  value 32k768  [Crystal DT-26]  (hidden comment: XTAL_1)

## Ports
3V3, 5V, 24V, 27V, +U, Ualarm, Uin

## Nets
3V3: C11.1 C15.2 C16.2 C18.2 C19.2 C20.2 C45.1 C47.2 C48.2 C49.2 C51.2 C52.2 C53.2 C54.2 C55.2 C56.2 DD3.16(VDDCORE/VCAP) DD3.17(VDD) DD3.29(ENVREG) DD3.37(VDD) DD3.59(VDD) DD3.62(VDD) DD3.75(VDDRX) DD3.76(VDDTX) DD3.81(VDDPLL) DD3.86(VDD) DD6.3(Reset) DD6.5(WP) DD6.6(Vcc) DD10.3(OUT) L9.2 R107.2 R138.2 R165.1 R171.2 VD1.2(Cathode) VD2.2(Cathode) VD3.2(Cathode) VD4.2(Cathode) VD5.2(Cathode) VD6.2(Cathode) VD7.2(Cathode) VD8.2(Cathode) VD9.2(Cathode) VD10.2(Cathode) VD49.2(Cathode) VD52.2(Cathode) XT9.3 ; port 3V3
5V: C38.1 C43.2 C50.2 C50.1.1 DD1.2(A1) DD1.8(Vcc) DD2.8(Vcc) DD4.8(Vcc) DD5.8(Vcc) DD10.1(IN) L7.1 R99.2 R100.2 R123.1 R124.1 R126.1 R127.1 R128.1 R129.1 R130.1 R131.1 R141.1 R176.2 R179.1 VD33.2 VD34.2 VD39.2 VD40.2 VD43.2 VD53.2(Cathode) VD61.2 VT21.3(C) VT22.3(C) VT23.3(C) VT24.3(C) VT25.3(C) XT6.1.1 ZQ1.1(OSC1) ; port 5V
24V: C36.1 C39.2 K1.1(A1) K2.1(A1) K3.1(A1) K4.1(A1) K5.1(A1) K6.1(A1) L6.1 VD21.2 VD22.2 VD23.2 VD24.2 VD25.2 VD26.2 VD37.2 ; port 24V
Earth: R178.1 XT8.8
GND: BT1.1(-) C1.1 C2.1 C3.1 C4.1 C5.1 C6.1 C7.1 C8.1 C9.1 C10.1 C11.2 C12.2 C13.1 C14.2 C15.1 C16.1 C17.2 C18.1 C19.1 C20.1 C21.2 C21.1.2 C22.1 C23.1 C24.1 C25.1 C26.1 C27.1 C28.1 C29.2 C30.2 C31.1 C32.2 C33.1 C34.1 C35.1 C36.2 C37.2 C38.2 C39.1 C40.1 C41.2 C42.1 C43.1 C45.2 C46.1 C47.1 C48.1 C49.1 C50.1 C50.1.2 C51.1 C52.1 C53.1 C54.1 C55.1 C56.1 C57.1 C58.1 C59.1 C60.1 C61.2 C62.1 DD1.1(A0) DD1.3(A2) DD1.4(Vss) DD1.7(WP) DD2.1(A0) DD2.2(A1) DD2.3(A2) DD2.4(Vss) DD2.7(WP) DD3.9(NC) DD3.15(VSS) DD3.31(AVSS) DD3.36(VSS) DD3.40(VSS) DD3.60(VSS) DD3.65(VSS) DD3.72(VSSRX) DD3.79(VSSTX) DD3.82(VSSPLL) DD3.85(VSS) DD4.5(Vss) DD5.4(Vss) DD6.7(Vss) DD7.2(E) DD7.4(GND) DD8.2(E) DD8.4(GND) DD9.4(GND) DD10.2(COM) HL13.2 R1.2 R2.2 R3.2 R4.2 R5.2 R6.2 R7.2 R8.2 R9.2 R10.2 R32.1 R33.1 R34.1 R35.1 R36.1 R37.1 R38.1 R39.1 R40.1 R41.1 R52.1 R53.1 R54.1 R55.1 R56.1 R57.1 R58.1 R59.1 R60.1 R61.1 R102.1 R108.1 R109.1 R110.2 R132.2 R135.2 R143.2 R144.2 R160.2 R170.2 R177.2 R178.2 RU1.2 RU2.2 RU3.2 RU4.2 RU5.2 RU6.2 RU7.2 RU8.2 RU9.2 RU10.2 RU11.2 RU12.2 RU13.2 RU14.2 RU15.2 RU16.2 RU17.2 RU18.2 RU19.2 RU20.2 RU21.1 RU22.1 RU23.1 RU24.1 RU24.1.1 RU25.2 RU26.2 RU27.2 RU28.1 RU29.2 RU30.1 RU31.1 RU32.1 RU33.1 RU34.1 RU35.1 RU36.1 RU37.1 VD1.1(Anode) VD2.1(Anode) VD3.1(Anode) VD4.1(Anode) VD5.1(Anode) VD6.1(Anode) VD7.1(Anode) VD8.1(Anode) VD9.1(Anode) VD10.1(Anode) VD11.1(anode) VD12.1(anode) VD13.1(anode) VD14.1(anode) VD15.1(anode) VD16.1(anode) VD17.1(anode) VD18.1(anode) VD19.1(anode) VD20.1(anode) VD29.1 VD30.1(Anode) VD32.1 VD35.1 VD36.1 VD37.1 VD38.2 VD41.1 VD42.1 VD43.1 VD44.1 VD45.1 VD46.1 VD47.1 VD48.2 VD49.1(Anode) VD50.1 VD51.1 VD52.1(Anode) VD53.1(Anode) VD54.1 VD55.1 VD56.1 VD57.1 VD59.1 VD60.1 VT1.2(E) VT2.2(E) VT3.2(E) VT4.2(E) VT5.2(E) VT6.2(E) VT7.2(E) VT8.2(E) VT9.2(E) VT10.2(E) VT26.2(E) VT27.2(E) VT28.2(E) VT29.2(E) VT30.2(E) VT31.2(E) VT32.2(E) VT33.2(E) VT34.2(E) VT35.2(E) VT36.2(E) VT37.2(E) XT1.1.1 XT1.1.2 XT2.5.1 XT2.5.2 XT3.5.1 XT3.5.2 XT6.2.1 XT6.2.2 XT9.4
UH: C37.1 C42.2 L5.1 R72.2 R73.2 R74.2 R75.2 R76.2 R77.2 R78.2 R79.2 R80.2 R81.2 R133.2 VD11.2(cathode) VD12.2(cathode) VD13.2(cathode) VD14.2(cathode) VD15.2(cathode) VD16.2(cathode) VD17.2(cathode) VD18.2(cathode) VD19.2(cathode) VD20.2(cathode) VD32.2 VT11.2(E) VT12.2(E) VT13.2(E) VT14.2(E) VT15.2(E) VT16.2(E) VT17.2(E) VT18.2(E) VT19.2(E) VT20.2(E) ; port 27V
1-Wire: DD3.42(RA4/T0CKI) R111.2
+U: RI4.1 RI7.1 VD27.1 XT1.2.1 XT1.2.2 ; port +U
BEEP: DD3.38(RG7) R84.1
Beep1: DD3.51(RG3/CCP4/P3D) R113.2
Beep2: DD3.44(RC0/T1OSO/T13CKI) R115.2
C1: DD3.93(RE7/AD15/ECCP2/P2A) R91.1
C2: DD3.92(RD0/AD0/PSP0) R92.1
C3: DD3.91(RD1/AD1/PSP1) R86.1
C4: DD3.90(RD2/AD2/PSP2) R87.1
C5: DD3.89(RD3/AD3/PSP3) R93.1
CS: DD3.83(RD7/AD7/PSP7/~{SS2}) DD6.4(CS) R165.2
D0-1: DD3.6(RB1/INT1) R118.2
D0-2: DD3.8(RB3/INT3/ECCP2/P2A) R121.2
D1-1: DD3.5(RB0/INT0/FLT0) R117.2
D1-2: DD3.7(RB2/INT2) R120.2
Door1: C27.2 DD3.99(RH0/A16) R119.2
Door2: C28.2 DD3.58(RJ6/~{LB}) R122.2
Exit1: C25.2 DD3.100(RH1/A17) R114.2
Exit2: C26.2 DD3.43(RC1/T1OSI/ECCP2/P2A) R116.2
K1: DD3.66(RJ2/~{WRL}) R83.1
K2: DD3.11(RG5) R98.1
K3: DD3.68(RB5/KBI1) R82.1
K4: DD3.69(RB4/KBI0) R95.1
K5: DD3.1(RH2/A18) R96.1
K6: DD3.2(RH3/A19) R97.1
LEDA: DD3.35(RA0/LEDA/AN0) XT8.11
LEDB: DD3.34(RA1/LEDB/AN1) XT8.9
LEDG1: DD3.45(RC6/TX1/CK1) R167.2
LEDG2: DD3.53(RC2/ECCP1/P1A) R169.2
LEDR1: DD3.61(RJ3/~{WRH}) R166.2
LEDR2: DD3.56(RC5/SDO1) R168.2
MCLR: DD3.13(~{MCLR}) R105.1 XT9.5
osc_n: C12.1 DD3.64(OSC2/CLKO) ZQ2.1(OSC1)
osc_p: C14.1 DD3.63(OSC1/CLKI) ZQ2.2(OSC2)
PGC: DD3.67(RB6/KBI2/PGC) XT9.1
PGD: DD3.57(RB7/KBI3/PGD) XT9.2
R/T: DD3.71(RG0/ECCP3/P3A) DD4.2(~{RE}) DD4.3(DE) R177.1
RxD: DD3.52(RG2/RX2/DT2) DD4.1(RO) R176.1
S1: DD3.98(RE2/AD10/~{CS}/P2B) VT21.1(B)
S2: DD3.97(RE3/AD11/P3C) VT22.1(B)
S3: DD3.96(RE4/AD12/P3B) VT23.1(B)
S4: DD3.95(RE5/AD13/P1C) VT24.1(B)
S5: DD3.94(RE6/AD14/P1B) VT25.1(B)
SCK: DD3.84(RD6/AD6/PSP6/SCK2/SCL2) DD6.2(SCK)
SCL: DD1.6(SCL) DD2.6(SCL) DD3.54(RC3/SCK1/SCL1) DD5.6(SCL) R100.1
SDA: DD1.5(SDA) DD2.5(SDA) DD3.55(RC4/SDI1/SDA1) DD5.5(SDA) R99.1
SDI: DD3.87(RD5/AD5/PSP5/SDI2/SDA2) DD6.8(S0)
SDO: DD3.88(RD4/AD4/PSP4/SDO2) DD6.1(SI)
SH1: C1.2 DD3.19(RF6/AN11) R11.2 R32.2 VD10.3(COM)
SH2: C2.2 DD3.20(RF5/AN10/CVREF) R12.2 R33.2 VD1.3(COM)
SH3: C3.2 DD3.21(RF4/AN9) R13.2 R34.2 VD2.3(COM)
SH4: C4.2 DD3.22(RF3/AN8) R14.2 R35.2 VD3.3(COM)
SH5: C5.2 DD3.23(RF2/AN7/C1OUT) R15.2 R36.2 VD4.3(COM)
SH6: C6.2 DD3.24(RH7/AN15/P1B) R16.2 R37.2 VD5.3(COM)
SH7: C7.2 DD3.25(RH6/AN14/P1C) R17.2 R38.2 VD6.3(COM)
SH8: C8.2 DD3.28(RF1/AN6/C2OUT) R18.2 R39.2 VD7.3(COM)
SH9: C9.2 DD3.27(RH4/AN12/P3C) R19.2 R40.2 VD8.3(COM)
SH10: C10.2 DD3.26(RH5/AN13/P3B) R20.2 R41.2 VD9.3(COM)
SH LAM: C41.1 DD3.41(RA5/AN4) R174.2 VD49.3(COM)
SH SER: C46.2 DD3.12(RF0/AN5) R180.2 VD52.3(COM)
SP1: DD3.3(RE1/AD9/~{WR}/P2C) R65.1
SP2: DD3.4(RE0/AD8/~{RD}/P2D) R62.1
SP3: DD3.10(RG6) R63.1
SP4: DD3.14(RG4/CCP5/P1D) R64.1
SP5: DD3.18(RF7/~{SS1}) R66.1
SP6: DD3.39(RJ7/~{UB}) R67.1
SP7: DD3.47(RJ4/BA0) R68.1
SP8: DD3.48(RJ5/~{CE}) R69.1
SP9: DD3.49(RJ0/ALE) R70.1
SP10: DD3.50(RJ1/~{OE}) R71.1
TPIN_N: DD3.73(TPIN-) R125.2 XT8.6
TPIN_P: DD3.74(TPIN+) R112.1 XT8.3
TPOUT_N: C58.2 DD3.77(TPOUT-) L10.2
TPOUT_P: C57.2 DD3.78(TPOUT+) L8.2
TxD: DD3.70(RG1/TX2/CK2) DD4.4(DI)
Ualarm: C61.1 C62.2 L11.1 RI2.2 RI3.2 ; port Ualarm
UH1: R21.2 VD14.3(com) VT11.3(C)
UH2: R23.2 VD11.3(com) VT12.3(C)
UH3: R24.2 VD12.3(com) VT13.3(C)
UH4: R25.2 VD13.3(com) VT14.3(C)
UH5: R26.2 VD15.3(com) VT15.3(C)
UH6: R27.2 VD16.3(com) VT16.3(C)
UH7: R28.2 VD17.3(com) VT17.3(C)
UH8: R29.2 VD18.3(com) VT18.3(C)
UH9: R30.2 VD19.3(com) VT19.3(C)
UH10: R31.2 VD20.3(com) VT20.3(C)
Uin: C13.2 C21.1 C21.1.1 DD7.6(Vcc) DD8.6(Vcc) DD9.6(Vcc) L1.1 R101.1 R103.1 R142.1 R145.1 ; port Uin
Usen: DD3.33(RA2/AN2/VREF-) R145.2 R160.1
Vref: C40.2 DD3.32(RA3/AN3/VREF+) R133.1 R134.2
NetBT1_2: BT1.2(+) DD5.3(Bat)
NetC17_1: C17.1 DD3.30(AVDD)
NetC22_2: C22.2 DD9.3(Ct)
NetC23_2: C23.2 R105.2 R107.1
NetC24_2: C24.2 DD8.3(Ct)
NetC29_1: C29.1 C33.2 L6.2 R163.1 VD31.2(Catode)
NetC30_1: C30.1 C35.2 L4.1 L7.2 R162.1
NetC31_2: C31.2 DD7.3(Ct)
NetC32_1: C32.1 C34.2 L5.2 R164.1 VD28.2(Catode)
NetC59_2: C59.2 R112.2 R125.1
NetC60_2: C60.2 L9.1 R136.2 R137.1 XT8.4
NetDD3_46: DD3.46(RC7/RX1/DT1) R106.1
NetDD3_80: DD3.80(RBIAS) R104.2
NetDD4_6: DD4.6(A) RI5.2 VD59.2 XT23.1
NetDD4_7: DD4.7(B) R161.2 RI6.2 VD60.2
NetDD5_1: DD5.1(X1) ZQ3.1(OSC1)
NetDD5_2: DD5.2(X2) ZQ3.2(OSC2)
NetDD7_1: DD7.1(C) L2.1 VD28.1(Anode)
NetDD7_5: DD7.5(=) R144.1 R164.2
NetDD7_7: DD7.7(Isen) L2.2 R142.2
NetDD8_1: DD8.1(C) L3.1 VD31.1(Anode)
NetDD8_5: DD8.5(=) R143.1 R163.2
NetDD8_7: DD8.7(Isen) L3.2 R103.2
NetDD9_1: DD9.1(C) DD9.7(Isen) R101.2
NetDD9_2: DD9.2(E) L4.2 VD30.2(Catode)
NetDD9_5: DD9.5(=) R110.1 R162.2
NetHL1_1: HL1.1 HL2.1 HL3.1 HL4.1 HL5.1 R85.2
NetHL1_2: HL1.2 HL1.4 HL6.2 HL6.4 HL11.2 VT29.3(C)
NetHL1_3: HL1.3 HL2.3 HL3.3 HL4.3 HL5.3 R94.2
NetHL2_2: HL2.2 HL2.4 HL7.2 HL7.4 HL11.4 VT34.3(C)
NetHL3_2: HL3.2 HL3.4 HL8.2 HL8.4 HL12.2 VT35.3(C)
NetHL4_2: HL4.2 HL4.4 HL9.2 HL9.4 HL12.4 VT36.3(C)
NetHL5_2: HL5.2 HL5.4 HL10.2 HL10.4 VT37.3(C)
NetHL6_1: HL6.1 HL7.1 HL8.1 HL9.1 HL10.1 R88.2
NetHL6_3: HL6.3 HL7.3 HL8.3 HL9.3 HL10.3 R89.2
NetHL11_1: HL11.1 HL11.3 HL12.1 HL12.3 R90.2
NetHL13_1: HL13.1 R106.2
NetK1_2: K1.2(A2) VD21.1 VT26.3(C)
NetK1_11: K1.11(COM) XT4.1.2
NetK1_12: K1.12(NC) XT4.1.1
NetK1_14: K1.14(NO) XT4.2.1
NetK2_2: K2.2(A2) VD22.1 VT27.3(C)
NetK2_11: K2.11(COM) XT4.3.1
NetK2_12: K2.12(NC) XT4.2.2
NetK2_14: K2.14(NO) XT4.3.2
NetK3_2: K3.2(A2) VD23.1 VT28.3(C)
NetK3_11: K3.11(COM) XT4.4.2
NetK3_12: K3.12(NC) XT4.4.1
NetK3_14: K3.14(NO) XT4.5.1
NetK4_2: K4.2(A2) VD24.1 VT31.3(C)
NetK4_11: K4.11(COM) XT4.6.1
NetK4_12: K4.12(NC) XT4.5.2
NetK4_14: K4.14(NO) XT4.6.2
NetK5_2: K5.2(A2) VD25.1 VT32.3(C)
NetK5_11: K5.11(COM) RU27.1 XT5.1.1
NetK5_12: K5.12(NC) R138.1
NetK5_14: K5.14(NO) K5.22(NC) R140.1 R173.1
NetK5_21: K5.21(COM) RU25.1 XT5.1.2
NetK5_24: K5.24(NO) RI3.1
NetK6_2: K6.2(A2) VD26.1 VT33.3(C)
NetK6_11: K6.11(COM) RU29.1 XT5.2.1
NetK6_12: K6.12(NC) R171.1
NetK6_14: K6.14(NO) K6.22(NC) R172.1 R175.1
NetK6_21: K6.21(COM) RU26.1 XT5.2.2
NetK6_24: K6.24(NO) RI2.1
NetL1_2: L1.2 RI1.1 VD29.2
NetL8_1: L8.1 R136.1 XT8.1
NetL10_1: L10.1 R137.2 XT8.2
NetL11_2: L11.2 RI1.2 VD27.2
NetR1_1: R1.1 R11.1 RU11.1 XT7.1.2
NetR2_1: R2.1 R12.1 RU12.1 XT7.2.2
NetR3_1: R3.1 R13.1 RU20.1 XT7.3.2
NetR4_1: R4.1 R14.1 RU13.1 XT7.4.2
NetR5_1: R5.1 R15.1 RU18.1 XT7.5.2
NetR6_1: R6.1 R16.1 RU14.1 XT7.6.2
NetR7_1: R7.1 R17.1 RU19.1 XT7.7.2
NetR8_1: R8.1 R18.1 RU15.1 XT7.8.2
NetR9_1: R9.1 R19.1 RU16.1 XT7.9.2
NetR10_1: R10.1 R20.1 RU17.1 XT7.10.2
NetR21_1: R21.1 RU1.1 XT7.1.1
NetR23_1: R23.1 RU2.1 XT7.2.1
NetR24_1: R24.1 RU3.1 XT7.3.1
NetR25_1: R25.1 RU4.1 XT7.4.1
NetR26_1: R26.1 RU5.1 XT7.5.1
NetR27_1: R27.1 RU6.1 XT7.6.1
NetR28_1: R28.1 RU7.1 XT7.7.1
NetR29_1: R29.1 RU8.1 XT7.8.1
NetR30_1: R30.1 RU9.1 XT7.9.1
NetR31_1: R31.1 RU10.1 XT7.10.1
NetR42_1: R42.1 R72.1 VT12.1(B)
NetR42_2: R42.2 VT1.3(C)
NetR43_1: R43.1 R73.1 VT13.1(B)
NetR43_2: R43.2 VT2.3(C)
NetR44_1: R44.1 R74.1 VT14.1(B)
NetR44_2: R44.2 VT3.3(C)
NetR45_1: R45.1 R75.1 VT11.1(B)
NetR45_2: R45.2 VT7.3(C)
NetR46_1: R46.1 R76.1 VT15.1(B)
NetR46_2: R46.2 VT4.3(C)
NetR47_1: R47.1 R77.1 VT16.1(B)
NetR47_2: R47.2 VT5.3(C)
NetR48_1: R48.1 R78.1 VT17.1(B)
NetR48_2: R48.2 VT6.3(C)
NetR49_1: R49.1 R79.1 VT18.1(B)
NetR49_2: R49.2 VT8.3(C)
NetR50_1: R50.1 R80.1 VT19.1(B)
NetR50_2: R50.2 VT9.3(C)
NetR51_1: R51.1 R81.1 VT20.1(B)
NetR51_2: R51.2 VT10.3(C)
NetR52_2: R52.2 R62.2 VT1.1(B)
NetR53_2: R53.2 R63.2 VT2.1(B)
NetR54_2: R54.2 R64.2 VT3.1(B)
NetR55_2: R55.2 R65.2 VT7.1(B)
NetR56_2: R56.2 R66.2 VT4.1(B)
NetR57_2: R57.2 R67.2 VT5.1(B)
NetR58_2: R58.2 R68.2 VT6.1(B)
NetR59_2: R59.2 R69.2 VT8.1(B)
NetR60_2: R60.2 R70.2 VT9.1(B)
NetR61_2: R61.2 R71.2 VT10.1(B)
NetR82_2: R82.2 VT28.1(B)
NetR83_2: R83.2 VT26.1(B)
NetR84_2: R84.2 VT30.1(B)
NetR85_1: R85.1 VT21.2(E)
NetR86_2: R86.2 VT35.1(B)
NetR87_2: R87.2 VT36.1(B)
NetR88_1: R88.1 VT23.2(E)
NetR89_1: R89.1 VT24.2(E)
NetR90_1: R90.1 VT25.2(E)
NetR91_2: R91.2 VT29.1(B)
NetR92_2: R92.2 VT34.1(B)
NetR93_2: R93.2 VT37.1(B)
NetR94_1: R94.1 VT22.2(E)
NetR95_2: R95.2 VT31.1(B)
NetR96_2: R96.2 VT32.1(B)
NetR97_2: R97.2 VT33.1(B)
NetR98_2: R98.2 VT27.1(B)
NetR102_2: R102.2 R104.1
NetR108_2: R108.2 XT8.12
NetR109_2: R109.2 XT8.10
NetR111_1: R111.1 R141.2 VD53.3(COM) XT6.1.2
NetR113_1: R113.1 R146.2 VD57.2
NetR114_1: R114.1 R124.2 R157.2 VD33.1 VD35.2
NetR115_1: R115.1 R147.2 VD56.2
NetR116_1: R116.1 R123.2 R159.2 VD34.1 VD36.2
NetR117_1: R117.1 R130.2 R149.2 VD47.2
NetR118_1: R118.1 R128.2 R150.2 VD45.2
NetR119_1: R119.1 R126.2 R151.2 VD39.1 VD42.2
NetR120_1: R120.1 R131.2 R153.2 VD46.2
NetR121_1: R121.1 R129.2 R154.2 VD44.2
NetR122_1: R122.1 R127.2 R155.2 VD40.1 VD41.2
NetR132_1: R132.1 R140.2 R173.2 R174.1 VD48.1
NetR134_1: R134.1 R135.1
NetR146_1: R146.1 RU36.2 XT2.1.1
NetR147_1: R147.1 RU37.2 XT3.1.1
NetR148_1: R148.1 RU34.2 XT2.1.2
NetR148_2: R148.2 R166.1 VD55.2
NetR149_1: R149.1 RU30.2 XT2.2.2
NetR150_1: R150.1 RU28.2 XT2.3.1
NetR151_1: R151.1 RU23.2 XT2.3.2
NetR152_1: R152.1 RU35.2 XT3.1.2
NetR152_2: R152.2 R168.1 VD54.2
NetR153_1: R153.1 RU31.2 XT3.2.2
NetR154_1: R154.1 RU24.1.2 XT3.3.1
NetR155_1: R155.1 RU24.2 XT3.3.2
NetR156_1: R156.1 RU32.2 XT2.2.1
NetR156_2: R156.2 R167.1 VD51.2
NetR157_1: R157.1 RU21.2 XT2.4.1
NetR158_1: R158.1 RU33.2 XT3.2.1
NetR158_2: R158.2 R169.1 VD50.2
NetR159_1: R159.1 RU22.2 XT3.4.1
NetR161_1: R161.1 XT23.2
NetR170_1: R170.1 R172.2 R175.2 R180.1 VD38.1
NetR179_2: R179.2 VD61.1 VT30.3(C) ZQ1.2(OSC2)
NetRI4_2: RI4.2 XT3.4.2
NetRI5_1: RI5.1 XT6.1
NetRI6_1: RI6.1 XT6.2
NetRI7_2: RI7.2 XT2.4.2

Not connected (* = marked no-connect by the designer): DD5 7(SQ); DD7 8(NC); DD8 8(NC); DD9 8(NC); XT8 5

## Buses and harness runs
bus BUS 0...500

## Layout directives
differential pair: osc_n, osc_p, TPIN_N, TPIN_P, TPOUT_N, TPOUT_P

## Notes on the sheet
- ШС 1+
- (near XT2.1) 1
- BEEP1
- ШС 1 -
- (near XT2.1) 2
- (near XT2.2) 3
- LEDG1
- LEDR1
- (near XT2.2) 4
- (near XT2.3) 5
- D1-1
- D0-1
- (near XT2.3) 6
- DOOR1
- ШС 2+
- (near XT2.4) 7
- (near XT2.4) 8
- +U
- EXIT1
- ШС 2 -
- (near XT2.5) 9
- GND
- VD9-VD13 & VD18-VD22: BZV55C5V6
- (near XT2.5) 10
- (near XT3.1) 1
- BEEP2
- ШС 3 -
- ШС 3+
- (near XT3.1) 2
- LEDG2
- LEDR2
- (near XT3.2) 3
- (near XT3.2) 4
- D1-2
- (near XT3.3) 5
- (near XT3.3) 6
- D0-2
- DOOR2
- (near XT3.4) 7
- EXIT2
- ШС 4+
- (near XT3.4) 8
- (near XT3.5) 9
- ШС 4 -
- (near XT3.5) 10
- (near XT6) 1
- RS-485A
- (near XT6) 2
- RS-485B
- ШС 5+
- (near XT4.1) 2
- (near XT4.1) 1
- COM1
- NC1
- ШС 5 -
- (near XT4.2) 3
- NO1
- (near XT4.3) 5
- (near XT4.2) 4
- COM2
- NC2
- (near XT4.3) 6
- NC3
- NO2
- (near XT4.4) 7
- (near XT4.4) 8
- COM3
- ШС 6 -
- ШС 6+
- (near XT4.5) 10
- (near XT4.5) 9
- NC4
- NO3
- (near XT4.6) 11
- COM4
- LAM+
- LAM-
- (near XT4.6) 12
- NO4
- (near XT6.1) 1
- +5V
- DQ
- ШС 7+
- (near XT6.1) 2
- (near XT6.2) 3
- ШС 7 -
- (near XT6.2) 4
- Iout: 160mA
- SER-
- ШС 8+
- SER+
- ШС 8 -
- Iout: 180mA
- ШС 9 -
- ШС 9+
- Iout: 220mA
- ШС 10+
- ШС 10 -
- (near C21.1) Uin: 10...26 Vdc
- Подп. дата
- Инв. № дубл.
- Взам. инв. №
- Подп. и дата
- Изм.
- Лист.
- № докум.
- Подп.
- Дата
- Лит.
- Масса
- Масштаб
- Разраб.
- Пров.
- Т. контр.
- Лист 1
- Листов
- 1:1
- Инв. № подп.
- Н. контр.
- Утв.
- Формат А1
- (in symbol 24LC512-I/SM) EEPROM
- (in symbol AT45DB011D) Flash
- (in symbol DS1307) Clock
- (in symbol LAN-Port) LAN PORT; 1:1; J1; J2; 75R; J3; J6; J4; J5; 1nF; J7; J8; Right LED; RJ45 Side; Left LED
- (in symbol PIC18F97J60-IP/T) CPU
- (in symbol Varistor) U
- (in symbol Varistor_hor) U